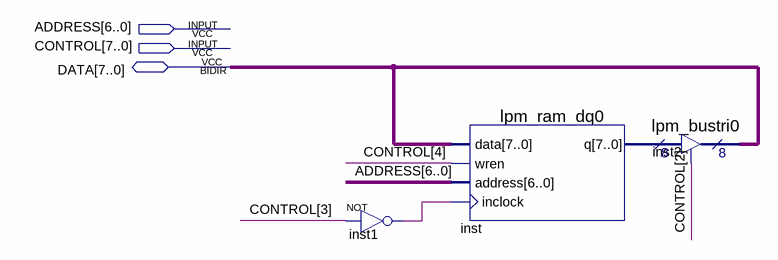
[diagram p0: schematic sheet]
// Quartus schematic RAM.bdf as structural Verilog: 3 symbols, 3 pins
module RAM (
  input  [6:0] ADDRESS,
  input  [7:0] CONTROL,
  inout  [7:0] DATA
);

  wire inst1_out;
  wire [7:0] inst_q;

  not inst1 (inst1_out, CONTROL[3]);
  lpm_ram_dq0 inst (.data(DATA), .wren(CONTROL[4]), .address(ADDRESS), .inclock(inst1_out), .q(inst_q));
  lpm_bustri0 inst2 (.enabledt(CONTROL[2]), .data(inst_q), .tridata(DATA));
endmodule
